# Altium project LSS_Top_Board_v3.5.PrjPcb (part 4 of 5)

## Sheet Motor-Driver-Sheet.SchDoc
size A4; DocumentNumber: 6; SheetNumber: 6; SheetTotal: 10
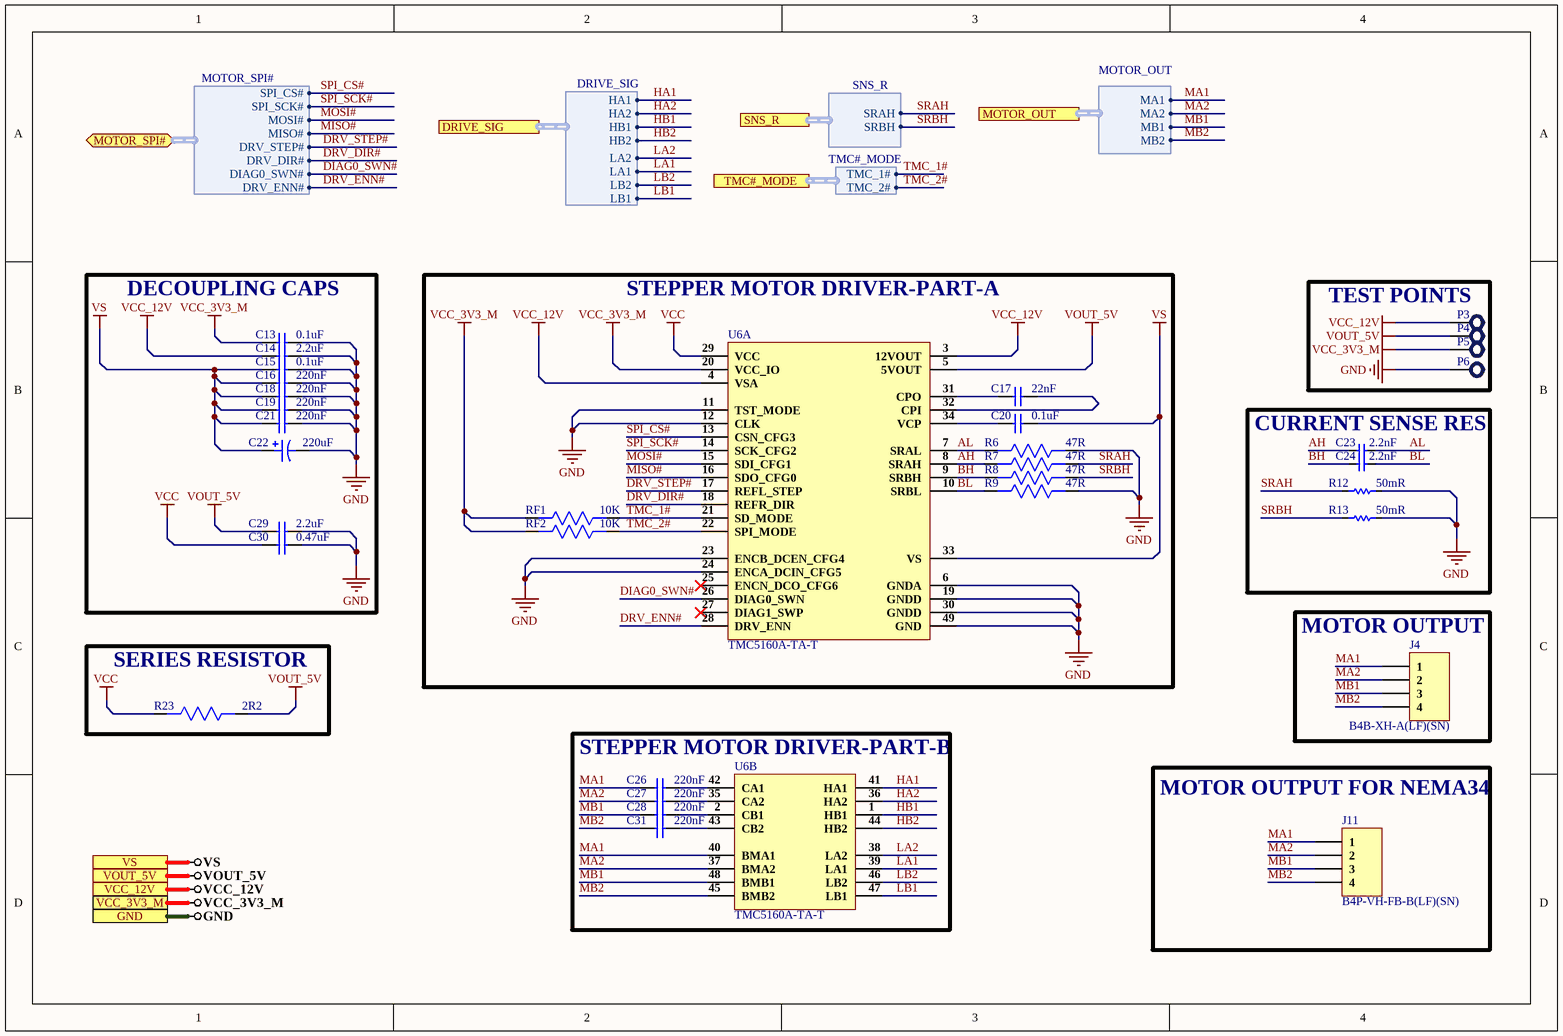
[diagram p5: Motor-Driver-Sheet.SchDoc]

### Parts
C13  0.1uF  [Cap 0603]
C14  2.2uF  [Cap 0603]
C15  0.1uF  [Cap 0603]
C16  220nF  [Cap0805]
C17  22nF  [Cap 0603]
C18  220nF  [Cap0805]
C19  220nF  [Cap0805]
C20  0.1uF  [Cap 0603]
C21  220nF  [Cap0805]
C22  220uF  [189RV0038]
C23  2.2nF  [Cap-0603]
C24  2.2nF  [Cap-0603]
C26  220nF  [Cap0805]
C27  220nF  [Cap0805]
C28  220nF  [Cap0805]
C29  2.2uF  [Cap 0603]
C30  0.47uF  [Cap 0603]
C31  220nF  [Cap0805]
J4  B4B-XH-A(LF)(SN)  [B4B-XH-A(LF)(SN)]
J11  B4P-VH-FB-B(LF)(SN)  [B4P-VH-FB-B(LF)(SN)]
P3  Test Point  [TEST POINT]  (value not drawn)
P4  Test Point  [TEST POINT]  (value not drawn)
P5  Test Point  [TEST POINT]  (value not drawn)
P6  Test Point  [TEST POINT]  (value not drawn)
R6  47R  [Res0603]
R7  47R  [Res0603]
R8  47R  [Res0603]
R9  47R  [Res0603]
R12  50mR  [RES-2512]
R13  50mR  [RES-2512]
R23  2R2  [Res0603]
RF1  10K  [Res0603]
RF2  10K  [Res0603]
U6  TMC5160A-TA-T  [48-tqfp-ep (7x7)]  (parts A,B of 2)

### Blocks framed on the sheet
DECOUPLING CAPS: C13-C16 C18 C19 C21 C22 C29 C30
STEPPER MOTOR DRIVER-PART-A: C17 C20 R6-R9 RF1 RF2 U6
TEST POINTS: P3-P6
CURRENT SENSE RES: C23 C24 R12 R13
MOTOR OUTPUT: J4
SERIES RESISTOR: R23
STEPPER MOTOR DRIVER-PART-B: C26-C28 C31 U6
MOTOR OUTPUT FOR NEMA34: J11

### Ports
DRIVE_SIG (harness DRIVE_SIG), GND, MOTOR_OUT (harness MOTOR_OUT), MOTOR_SPI# (bidir, harness MOTOR_SPI#), SNS_R (harness SNS_R), TMC#_MODE (harness TMC#_MODE), VCC_3V3_M, VCC_12V, VOUT_5V, VS

### Harnesses
SNS_R: SRAH, SRBH
DRIVE_SIG: HA1, HA2, HB1, HB2, LA2, LA1, LB2, LB1
MOTOR_OUT: MA1, MA2, MB1, MB2
TMC#_MODE: TMC_1#, TMC_2#
MOTOR_SPI#: SPI_CS#, SPI_SCK#, MOSI#, MISO#, DRV_STEP#, DRV_DIR#, DIAG0_SWN#, DRV_ENN#

### Nets
GND: C13.2 C14.2 C15.2 C16.2 C18.2 C19.2 C21.2 C22.2 C29.2 C30.2 P6.1 R6.1 R9.1 R12.2 R13.2 U6.6(GNDA) U6.11(TST_MODE) U6.12(CLK) U6.19(GNDD) U6.23(ENCB_DCEN_CFG4) U6.24(ENCA_DCIN_CFG5) U6.30(GNDD) U6.49(GND) ; port GND
VCC: C30.1 R23.2 U6.29(VCC)
VCC_3V3_M: C13.1 P5.1 RF1.2 RF2.2 U6.20(VCC_IO) ; port VCC_3V3_M
VCC_12V: C14.1 P3.1 U6.3(12VOUT) U6.4(VSA) ; port VCC_12V
VOUT_5V: C29.1 P4.1 R23.1 U6.5(5VOUT) ; port VOUT_5V
VS: C15.1 C16.1 C18.1 C19.1 C20.2 C21.1 C22.1 U6.33(VS) ; port VS
AH: C23.1 R7.2 U6.8(SRAH)
AL: C23.2 R6.2 U6.7(SRAL)
BH: C24.1 R8.2 U6.9(SRBH)
BL: C24.2 R9.2 U6.10(SRBL)
DIAG0_SWN#: U6.26(DIAG0_SWN) ; port MOTOR_SPI#.DIAG0_SWN#
DRV_DIR#: U6.18(REFR_DIR) ; port MOTOR_SPI#.DRV_DIR#
DRV_ENN#: U6.28(DRV_ENN) ; port MOTOR_SPI#.DRV_ENN#
DRV_STEP#: U6.17(REFL_STEP) ; port MOTOR_SPI#.DRV_STEP#
HA1: U6.41(HA1) ; port DRIVE_SIG.HA1
HA2: U6.36(HA2) ; port DRIVE_SIG.HA2
HB1: U6.1(HB1) ; port DRIVE_SIG.HB1
HB2: U6.44(HB2) ; port DRIVE_SIG.HB2
LA1: U6.39(LA1) ; port DRIVE_SIG.LA1
LA2: U6.38(LA2) ; port DRIVE_SIG.LA2
LB1: U6.47(LB1) ; port DRIVE_SIG.LB1
LB2: U6.46(LB2) ; port DRIVE_SIG.LB2
MA1: C26.1 J4.1 J11.1 U6.40(BMA1) ; port MOTOR_OUT.MA1
MA2: C27.1 J4.2 J11.2 U6.37(BMA2) ; port MOTOR_OUT.MA2
MB1: C28.1 J4.3 J11.3 U6.48(BMB1) ; port MOTOR_OUT.MB1
MB2: C31.1 J4.4 J11.4 U6.45(BMB2) ; port MOTOR_OUT.MB2
MISO#: U6.16(SDO_CFG0) ; port MOTOR_SPI#.MISO#
MOSI#: U6.15(SDI_CFG1) ; port MOTOR_SPI#.MOSI#
SPI_CS#: U6.13(CSN_CFG3) ; port MOTOR_SPI#.SPI_CS#
SPI_SCK#: U6.14(SCK_CFG2) ; port MOTOR_SPI#.SPI_SCK#
SRAH: R7.1 R12.1 ; port SNS_R.SRAH
SRBH: R8.1 R13.1 ; port SNS_R.SRBH
TMC_1#: RF1.1 U6.21(SD_MODE) ; port TMC#_MODE.TMC_1#
TMC_2#: RF2.1 U6.22(SPI_MODE) ; port TMC#_MODE.TMC_2#
NetC17_1: C17.1 U6.31(CPO)
NetC17_2: C17.2 U6.32(CPI)
NetC20_1: C20.1 U6.34(VCP)
NetC26_2: C26.2 U6.42(CA1)
NetC27_2: C27.2 U6.35(CA2)
NetC28_2: C28.2 U6.2(CB1)
NetC31_2: C31.2 U6.43(CB2)

Not connected (* = marked no-connect by the designer): U6 25(ENCN_DCO_CFG6)* 27(DIAG1_SWP)*

### Library data of the parts
C13 C15 C20 = CL10B104KB8NNNC: Cap Ceramic 0.1uF 50VDC X7R 10% SMD 0603 Paper T/R; Manufacturer: Samsung; Capacitance: 100nF; Voltage Rating: 50V; Supplier 1: Digi-Key; Manufacturer Part Number: CL10B104KB8NNNC; RoHS: Yes; Category: Ceramic Capacitors; Stock 1: 3998791; Pricing 1: 1=0.10000, 10=0.03000, 50=0.01640, 100=0.01340, 500=0.00954, 1000=0.00750 (USD); Mount: Surface Mount; Case/Package: 0603; Case Code (Metric): 1608; Case Code (Imperial): 0603; Material: Ceramic; Contact Plating: Tin; Min Operating Temperature: -55°C; Max Operating Temperature: 125°C; Dielectric: X7R; Tolerance: 10%; Package Quantity: 1; Packaging: Tape and Reel; Voltage: 50V; Voltage Rating (DC): 50V; Series: CL; Construction: Flat; Length: 1.6mm; Width: 0.031inch; Height: 0.8mm; Depth: 0.8mm; Thickness: 0.035inch; Radiation Hardening: No; Lead Free: Lead Free; RoHS Compliant: Yes; ComponentLink1URL: https://datasheet.ciiva.com/25803/cl10b104kb8nnnc-25803393.pdf?src-supplier=Digi-Key; ComponentLink1Description: https://datasheet.ciiva.com/25803/cl10b104kb8nnnc-25803393.pdf?src-supplier=Digi-Key; ComponentLink2URL: https://datasheet.ciiva.com/26838/getdatasheetpartid-89097-26838411.pdf?src-supplier=Verical; ComponentLink2Description: https://datasheet.ciiva.com/26838/getdatasheetpartid-89097-26838411.pdf?src-supplier=Verical; ComponentLink3URL: https://datasheet.ciiva.com/29198/456651-da-01-en-vs-kondensator-0605-29198839.pdf?src-supplier=Conrad; ComponentLink3Description: https://datasheet.ciiva.com/29198/456651-da-01-en-vs-kondensator-0605-29198839.pdf?src-supplier=Conrad; Supplier Part Number 1: 1276-1000-1-ND
C14 C29 = GRM188R6YA225KA12D: CAP, 2.2µF, 35V, 10%, X5R, 0603; Manufacturer: Murata; Material: Ceramic; Supplier 1: Digi-Key; Manufacturer Part Number: GRM188R6YA225KA12D; RoHS: Yes; Category: Ceramic Capacitors; Stock 1: 81665; Pricing 1: 1=0.21000, 10=0.14100, 50=0.08480, 100=0.07170, 500=0.04904, 1000=0.04338 (USD); Mount: Surface Mount; Case/Package: 0603; Case Code (Metric): 1608; Case Code (Imperial): 0603; Weight: 0.000222oz; Min Operating Temperature: -55°C; Max Operating Temperature: 85°C; Package Quantity: 4000; Packaging: Tape and Reel; Capacitance: 2.2uF; Tolerance: 10%; Voltage Rating: 35V; Dielectric: X5R; Voltage: 35V; Termination: SMD/SMT; Voltage Rating (DC): 35V; Series: GRM; Length: 1.6mm; Width: 0.8mm; Height: 0.8mm; Thickness: 0.035inch; Depth: 0.8mm; REACH SVHC: No SVHC; Lead Free: Lead Free; RoHS Compliant: Yes; ComponentLink1URL: https://datasheet.ciiva.com/14906/partnumbering-e-01-14906490.pdf?src-supplier=Digi-Key; ComponentLink1Description: https://datasheet.ciiva.com/14906/partnumbering-e-01-14906490.pdf?src-supplier=Digi-Key; ComponentLink2URL: https://datasheet.ciiva.com/14906/partnumbering-e-01-14906491.pdf?src-supplier=Digi-Key; ComponentLink2Description: https://datasheet.ciiva.com/14906/partnumbering-e-01-14906491.pdf?src-supplier=Digi-Key; ComponentLink3URL: https://datasheet.ciiva.com/14906/partnumbering-e-01-14906492.pdf?src-supplier=Digi-Key; ComponentLink3Description: https://datasheet.ciiva.com/14906/partnumbering-e-01-14906492.pdf?src-supplier=Digi-Key; Supplier Part Number 1: 490-7204-1-ND
C16 C18 C19 C21 = 08051C224K4T2A: Cap Ceramic 0.22uF 100V X7R 10% SMD 0805 125°C Embossed T/R; Manufacturer: Kyocera AVX; Supplier 1: Digi-Key; Manufacturer Part Number: 08051C224K4T2A; RoHS: Yes; Category: Ceramic Capacitors; Stock 1: 151; Pricing 1: 1=0.27000, 10=0.18500, 50=0.12320, 100=0.10470, 500=0.07392, 1000=0.06468 (USD); Mount: Surface Mount; Case/Package: 0805; Contact Plating: Tin; Min Operating Temperature: -55°C; Max Operating Temperature: 125°C; Termination: Wraparound; Tolerance: 10%; Capacitance: 220nF; Dielectric: X7R; Voltage Rating (DC): 100V; Length: 2.01mm; RoHS Compliant: Yes; ComponentLink1URL: http://datasheets.avx.com/AutoMLCC.pdf?src-supplier=Avnet+Asia; ComponentLink1Description: http://datasheets.avx.com/AutoMLCC.pdf?src-supplier=Avnet+Asia; Supplier Part Number 1: 478-13049-1-ND
C17 = CGA3E2X7R2A223K080AA: 0603 .022uF 100volts X7R 10% T=0.8mm; Manufacturer: TDK; Voltage Rating: 100V; Supplier 1: Digi-Key; Manufacturer Part Number: CGA3E2X7R2A223K080AA; RoHS: Yes; Category: Ceramic Capacitors; Stock 1: 56079; Pricing 1: 1=0.11000, 10=0.07600, 50=0.04340, 100=0.03590, 500=0.02516, 1000=0.02083 (USD); Mount: Surface Mount; Case/Package: 0603; Case Code (Metric): 1608; Case Code (Imperial): 0603; Weight: 7.1E-05oz; Min Operating Temperature: -55°C; Max Operating Temperature: 125°C; Capacitance: 22nF; Tolerance: 10%; Packaging: Tape and Reel; Voltage Rating (DC): 100V; Dielectric: X7R; Termination: SMD/SMT; Series: CGA; Package Quantity: 1; Resistor Type: Ceramic; Length: 1.6mm; Width: 0.031inch; Height: 0.8mm; Thickness: 0.035inch; Depth: 0.8mm; Ratings: AEC-Q200; RoHS Compliant: Yes; REACH SVHC: No SVHC; ComponentLink1URL: https://datasheet.ciiva.com/22725/1735406-22725648.pdf?src-supplier=Element14; ComponentLink1Description: https://datasheet.ciiva.com/22725/1735406-22725648.pdf?src-supplier=Element14; ComponentLink2URL: https://datasheet.ciiva.com/24218/cga3e2x7r2a223k080aa-266292-24218959.pdf?src-supplier=Mouser; ComponentLink2Description: https://datasheet.ciiva.com/24218/cga3e2x7r2a223k080aa-266292-24218959.pdf?src-supplier=Mouser; ComponentLink3URL: https://datasheet.ciiva.com/7975/1807242-7975349.pdf?src-supplier=Element14; ComponentLink3Description: https://datasheet.ciiva.com/7975/1807242-7975349.pdf?src-supplier=Element14; Supplier Part Number 1: 445-5814-1-ND
C22 = 189RV0038: 220uF 63V 225mA@100KHz ±20% SMD,D10xL10.5mm Aluminum Electrolytic Capacitors - SMD ROHS; Manufacturer: KNSCHA; Manufacturer Part Number: 189RV0038; Package: SMD,D10xL10.5mm; LCSC Part Number: C7471900; Item Type: Capacitor; ComponentLink1Description: LCSC; ComponentLink1URL: https://www.lcsc.com/product-detail/Aluminum-Electrolytic-Capacitors-SMD_KNSCHA-189RV0038_C7471900.html
C23 C24 = CC0603KRX7R9BB222: CAP CER 2200PF 50V X7R 0603; Manufacturer: Yageo; Tolerance: 10%; Insulation Resistance: 10GR; Dissipation Factor: 2.5%; Supplier 1: RSComponents; Manufacturer Part Number: CC0603KRX7R9BB222; RoHS: Yes; Category: Ceramic Capacitors; Stock 1: 1; Pricing 1: 4000=0.00500 (USD); Mount: Surface Mount; Case/Package: 0603; Number of Pins: 2; Case Code (Metric): 1608; Case Code (Imperial): 0603; Min Operating Temperature: -55°C; Max Operating Temperature: 125°C; Capacitance: 2.2nF; Dielectric: X7R; Package Quantity: 1; Voltage Rating: 50V; Packaging: Tape and Reel; Voltage Rating (DC): 50V; Termination: SMD/SMT; Resistor Type: Ceramic; Voltage: 50V; Series: CC; Length: 1.6mm; Width: 0.031inch; Height: 0.8mm; Thickness: 0.035inch; Depth: 0.8mm; Radiation Hardening: No; REACH SVHC: No SVHC; Lead Free: Lead Free; Halogen Free: Halogen Free; RoHS Compliant: Yes; ComponentLink1URL: https://datasheet.ciiva.com/23768/1079489-23768004.pdf?src-supplier=Newark; ComponentLink1Description: https://datasheet.ciiva.com/23768/1079489-23768004.pdf?src-supplier=Newark; ComponentLink2URL: https://datasheet.ciiva.com/11788/0900766b8079c870-11788403.pdf?src-supplier=RSComponents; ComponentLink2Description: https://datasheet.ciiva.com/11788/0900766b8079c870-11788403.pdf?src-supplier=RSComponents; ComponentLink3URL: https://datasheet.ciiva.com/26862/getdatasheetpartid-403587-26862854.pdf?src-supplier=Verical; ComponentLink3Description: https://datasheet.ciiva.com/26862/getdatasheetpartid-403587-26862854.pdf?src-supplier=Verical; ComponentLink4URL: https://datasheet.ciiva.com/8033/70765-8033863.pdf?src-supplier=Element14; ComponentLink4Description: https://datasheet.ciiva.com/8033/70765-8033863.pdf?src-supplier=Element14; ComponentLink5URL: https://datasheet.ciiva.com/7978/1489800-7978172.pdf?src-supplier=Element14; ComponentLink5Description: https://datasheet.ciiva.com/7978/1489800-7978172.pdf?src-supplier=Element14; ComponentLink6URL: https://datasheet.ciiva.com/28450/1489800-28450632.pdf?src-supplier=Element14; ComponentLink6Description: https://datasheet.ciiva.com/28450/1489800-28450632.pdf?src-supplier=Element14; ComponentLink7URL: https://datasheet.ciiva.com/155/mlccorderingcode-155921.pdf?src-supplier=Digi-Key; ComponentLink7Description: https://datasheet.ciiva.com/155/mlccorderingcode-155921.pdf?src-supplier=Digi-Key; ComponentLink8URL: https://datasheet.ciiva.com/155/mlccorderingcode-155920.pdf?src-supplier=Digi-Key; ComponentLink8Description: https://datasheet.ciiva.com/155/mlccorderingcode-155920.pdf?src-supplier=Digi-Key; ComponentLink9URL: https://datasheet.ciiva.com/155/mlccorderingcode-155922.pdf?src-supplier=Digi-Key; ComponentLink9Description: https://datasheet.ciiva.com/155/mlccorderingcode-155922.pdf?src-supplier=Digi-Key; ComponentLink10URL: https://datasheet.ciiva.com/8033/1489800-8033864.pdf?src-supplier=Element14; ComponentLink10Description: https://datasheet.ciiva.com/8033/1489800-8033864.pdf?src-supplier=Element14; ComponentLink11URL: https://datasheet.ciiva.com/8033/1489800-8033862.pdf?src-supplier=Element14; ComponentLink11Description: https://datasheet.ciiva.com/8033/1489800-8033862.pdf?src-supplier=Element14; ComponentLink12URL: https://datasheet.ciiva.com/16625/upy-gphc-x7r-6-3v-to-50v-8-16625531.pdf?src-supplier=Avnet+Europe; ComponentLink12Description: https://datasheet.ciiva.com/16625/upy-gphc-x7r-6-3v-to-50v-8-16625531.pdf?src-supplier=Avnet+Europe; Supplier Part Number 1: 6169509; LCSC Part Number: C107082
C26-C28 C31 = 08051C224K4T2A: CAP CER 0.22UF 100V X7R 0805; Manufacturer: Kyocera AVX; Tolerance: 10%; Supplier 1: Digi-Key; Manufacturer Part Number: 08051C224K4T2A; RoHS: Yes; Category: Ceramic Capacitors; Stock 1: 151; Pricing 1: 1=0.27000, 10=0.18500, 50=0.12320, 100=0.10470, 500=0.07392, 1000=0.06468 (USD); Mount: Surface Mount; Case/Package: 0805; Contact Plating: Tin; Min Operating Temperature: -55°C; Max Operating Temperature: 125°C; Termination: Wraparound; Capacitance: 220nF; Dielectric: X7R; Voltage Rating (DC): 100V; Length: 2.01mm; RoHS Compliant: Yes; ComponentLink1URL: http://datasheets.avx.com/AutoMLCC.pdf?src-supplier=Avnet+Asia; ComponentLink1Description: http://datasheets.avx.com/AutoMLCC.pdf?src-supplier=Avnet+Asia; Supplier Part Number 1: 478-13049-1-ND
C30 = UMK107B7474KA-TR: CAP CER 0.47uF 50V X7R 0603; Manufacturer: Taiyo Yuden; Tolerance: 10%; Capacitance: 470nF; Supplier 1: Digi-Key; Manufacturer Part Number: UMK107B7474KA-TR; RoHS: Yes; Category: Ceramic Capacitors; Stock 1: 81; Pricing 1: 1=0.21000, 10=0.14800, 50=0.08400, 100=0.06950, 500=0.04876, 1000=0.04036 (USD); Mount: Surface Mount; Case/Package: 0603; Case Code (Metric): 1608; Case Code (Imperial): 0603; Min Operating Temperature: -55°C; Max Operating Temperature: 125°C; Packaging: Tape and Reel; Voltage Rating: 50V; Package Quantity: 1; Dielectric: X7R; Termination: SMD/SMT; Voltage: 50V; Series: M; Voltage Rating (DC): 50V; Construction: Flat; Length: 1.6mm; Width: 0.031inch; Height: 0.8mm; Depth: 0.8mm; Thickness: 0.035inch; Radiation Hardening: No; RoHS Compliant: Yes; Lead Free: Lead Free; Halogen Free: Halogen Free; ComponentLink1URL: https://datasheet.ciiva.com/30063/972umk107b7474ka-tr-30063804.pdf?src-supplier=Onlinecomponents.com; ComponentLink1Description: https://datasheet.ciiva.com/30063/972umk107b7474ka-tr-30063804.pdf?src-supplier=Onlinecomponents.com; ComponentLink2URL: https://datasheet.ciiva.com/11600/umk107b7474ka-tr-ss-11600367.pdf?src-supplier=Avnet; ComponentLink2Description: https://datasheet.ciiva.com/11600/umk107b7474ka-tr-ss-11600367.pdf?src-supplier=Avnet; ComponentLink3URL: https://datasheet.ciiva.com/15922/257umk107b7474ka-tr-15922607.pdf?src-supplier=Onlinecomponents.com; ComponentLink3Description: https://datasheet.ciiva.com/15922/257umk107b7474ka-tr-15922607.pdf?src-supplier=Onlinecomponents.com; ComponentLink4URL: https://datasheet.ciiva.com/6274/mlcc-all-e-6274710.pdf?src-supplier=Digi-Key; ComponentLink4Description: https://datasheet.ciiva.com/6274/mlcc-all-e-6274710.pdf?src-supplier=Digi-Key; ComponentLink5URL: https://datasheet.ciiva.com/5412/mlcc01-e-5412119.pdf?src-supplier=Mouser; ComponentLink5Description: https://datasheet.ciiva.com/5412/mlcc01-e-5412119.pdf?src-supplier=Mouser; ComponentLink6URL: https://datasheet.ciiva.com/6274/mlcc-all-e-6274712.pdf?src-supplier=Digi-Key; ComponentLink6Description: https://datasheet.ciiva.com/6274/mlcc-all-e-6274712.pdf?src-supplier=Digi-Key; ComponentLink7URL: https://datasheet.ciiva.com/6274/mlcc-all-e-6274713.pdf?src-supplier=Digi-Key; ComponentLink7Description: https://datasheet.ciiva.com/6274/mlcc-all-e-6274713.pdf?src-supplier=Digi-Key; Supplier Part Number 1: 587-3170-1-ND
J4 = B4B-XH-A(LF)(SN): CONN HEADER VERT 4POS 2.5MM; Manufacturer: JST; Current Rating: 3A; Gender: Male; Contact Resistance: 20mR; Voltage Rating (AC): 250V; Connector Type: Male Pin; Number of Positions: 4; Insulation Resistance: 1GR; Wire/Cable Gauge: 22AWG; Supplier 1: Future Electronics; Manufacturer Part Number: B4B-XH-A(LF)(SN); RoHS: Yes; Category: FFC / FPC; Pricing 1: 1=0.13000, 300=0.11300, 1000=0.11000, 3000=0.10700, 10000=0.10400 (USD); Mount: Through Hole; Contact Material: Brass; Material: Polyamide; Contact Plating: Tin,Copper,Lead; Color: Natural; Housing Material: Polyamide; Housing Color: White; Min Operating Temperature: -25°C; Max Operating Temperature: 85°C; Number of Rows: 1; Max Current Rating: 3A; Package Quantity: 500; Packaging: Bulk; Voltage Rating: 250V; Termination: Press-Fit; Max Voltage Rating (AC): 250V; Max Voltage Rating (DC): 250V; Number of Contacts: 4; Orientation: Straight; Length: 12.4mm; Pitch: 2.5mm; Lead Pitch: 2.5mm; Depth: 5.75mm; REACH SVHC: No SVHC; Lead Free: Lead Free; ComponentLink1URL: https://datasheet.ciiva.com/26894/getdatasheetpartid-455616-26894787.pdf?src-supplier=Verical; ComponentLink1Description: https://datasheet.ciiva.com/26894/getdatasheetpartid-455616-26894787.pdf?src-supplier=Verical; ComponentLink2URL: https://datasheet.ciiva.com/26924/getdatasheetpartid-640571-26924035.pdf?src-supplier=Verical; ComponentLink2Description: https://datasheet.ciiva.com/26924/getdatasheetpartid-640571-26924035.pdf?src-supplier=Verical; ComponentLink3URL: https://datasheet.ciiva.com/16203/b4b-xh-alfsn-16203642.pdf?src-supplier=Future+Electronics; ComponentLink3Description: https://datasheet.ciiva.com/16203/b4b-xh-alfsn-16203642.pdf?src-supplier=Future+Electronics; ComponentLink4URL: https://datasheet.ciiva.com/726/exh-726404.pdf?src-supplier=Digi-Key; ComponentLink4Description: https://datasheet.ciiva.com/726/exh-726404.pdf?src-supplier=Digi-Key; Supplier Part Number 1: 8134090
J11 = B4P-VH-FB-B(LF)(SN): CONN HEADER VERT 4POS 3.96MM; Manufacturer: JST; Number of Positions: 4; Supplier 1: Future Electronics; Manufacturer Part Number: B4P-VH-FB-B(LF)(SN); RoHS: Yes; Category: Connectors; Pricing 1: 1=0.22000, 200=0.19300, 500=0.18800, 2000=0.18200, 5000=0.17800 (USD); Mount: Through Hole; Termination: Crimp; Pitch: 3.96mm; Lead Free: Lead Free; ComponentLink1URL: https://datasheet.ciiva.com/16292/b4p-vh-fb-blfsn-16292309.pdf?src-supplier=Future+Electronics; ComponentLink1Description: https://datasheet.ciiva.com/16292/b4p-vh-fb-blfsn-16292309.pdf?src-supplier=Future+Electronics; Supplier Part Number 1: 4271011
P3-P6 = TEST POINT: Test Point ON
R6-R9 = RC0603FR-0747RL: RES SMD 47OHM 0.1W 0603; Manufacturer: Yageo; Tolerance: 1%; Power Rating: 100mW; Voltage Rating (DC): 50V; Temperature Coefficient: 100ppm/°C; Voltage Rating: 75V; Supplier 1: Digi-Key; Manufacturer Part Number: RC0603FR-0747RL; RoHS: Yes; Category: Chip SMD Resistors; Stock 1: 596562; Pricing 1: 1=0.10000, 10=0.02400, 100=0.00970, 1000=0.00436, 2500=0.00378 (USD); Case/Package: 0603; Number of Pins: 2; Case Code (Imperial): 0603; Case Code (Metric): 1608; Weight: 7.1E-05oz; Size Code: 0603; Min Operating Temperature: -55°C; Max Operating Temperature: 155°C; Resistance: 47R; Packaging: Tape and Reel; Package Quantity: 1; Termination: SMD/SMT; Resistor Type: Thick Film; Number of Terminations: 2; Max Power Dissipation: 100mW; Features: Moisture Resistant; Series: RC; Construction: Rectangular; Resistance Tolerance: 1%; Length: 1.6mm; Width: 0.8mm; Height: 0.022inch; Depth: 0.8mm; REACH SVHC: Unknown; Lead Free: Lead Free; Military Standard: Not; RoHS Compliant: Yes; ComponentLink1URL: https://datasheet.ciiva.com/2453/pyu-r-int-thick-7-2453922.pdf?src-supplier=Digi-Key; ComponentLink1Description: https://datasheet.ciiva.com/2453/pyu-r-int-thick-7-2453922.pdf?src-supplier=Digi-Key; ComponentLink2URL: https://datasheet.ciiva.com/2453/pyu-r-int-thick-7-2453923.pdf?src-supplier=Digi-Key; ComponentLink2Description: https://datasheet.ciiva.com/2453/pyu-r-int-thick-7-2453923.pdf?src-supplier=Digi-Key; ComponentLink3URL: https://datasheet.ciiva.com/2453/pyu-r-int-thick-7-2453924.pdf?src-supplier=Digi-Key; ComponentLink3Description: https://datasheet.ciiva.com/2453/pyu-r-int-thick-7-2453924.pdf?src-supplier=Digi-Key; ComponentLink4URL: https://datasheet.ciiva.com/7746/443971-7746363.pdf?src-supplier=Element14; ComponentLink4Description: https://datasheet.ciiva.com/7746/443971-7746363.pdf?src-supplier=Element14; ComponentLink5URL: https://datasheet.ciiva.com/7746/443971-7746364.pdf?src-supplier=Element14; ComponentLink5Description: https://datasheet.ciiva.com/7746/443971-7746364.pdf?src-supplier=Element14; ComponentLink6URL: https://datasheet.ciiva.com/46440/1868787-46440908.pdf?src-supplier=Element14; ComponentLink6Description: https://datasheet.ciiva.com/46440/1868787-46440908.pdf?src-supplier=Element14; Supplier Part Number 1: 311-47.0HRCT-ND
R12 R13 = CRH2512FR050E04Z: 2W 50mΩ ±1% 2512 Current Sense Resistors/Shunt Resistors ROHS; Manufacturer: Ever Ohms Tech; Manufacturer Part Number: CRH2512FR050E04Z; Package: 2512; LCSC Part Number: C176035; ComponentLink1Description: LCSC; ComponentLink1URL: https://www.lcsc.com/product-detail/Current-Sense-Resistors-Shunt-Resistors_Ever-Ohms-Tech-CRH2512FR050E04Z_C176035.html; Item Type: Resistor
R23 = ERJ3GEYJ2R2V: RES SMD 2.2OHM 0603; Manufacturer: Panasonic; Manufacturer Part Number: ERJ-3GEYJ2R2V; Resistance: 2.2R; Tolerance: 5%; Temperature Coefficient: 600ppm/°C; Voltage Rating: 75V; Power Rating: 100mW; Voltage Rating (DC): 50V; Supplier 1: Digi-Key; RoHS: Yes; Category: Chip SMD Resistors; Stock 1: 2941010; Pricing 1: 1=0.10000, 10=0.05000, 100=0.02020, 1000=0.00905, 2500=0.00786 (USD); Mount: Surface Mount; Case/Package: 0603; Contact Plating: Tin; Case Code (Imperial): 0603; Case Code (Metric): 1608; Min Operating Temperature: -55°C; Max Operating Temperature: 155°C; Resistor Type: Thick Film; Packaging: Tape and Reel; Package Quantity: 1; Number of Terminations: 2; Termination: SMD/SMT; Max Power Dissipation: 100mW; Features: Automotive AEC-Q200; Series: ERJ; Resistance Tolerance: 5%; Construction: Rectangular; Technology: THICK FILM; Length: 1.6mm; Width: 0.8mm; Height: 0.45mm; Depth: 0.8mm; Radiation Hardening: No; REACH SVHC: No SVHC; Military Standard: Not; Lead Free: Lead Free; RoHS Compliant: Yes; ComponentLink1URL: https://datasheet.ciiva.com/11821/0900766b80f806dd-11821449.pdf?src-supplier=RSComponents; ComponentLink1Description: https://datasheet.ciiva.com/11821/0900766b80f806dd-11821449.pdf?src-supplier=RSComponents; ComponentLink2URL: https://datasheet.ciiva.com/46374/1500035-46374005.pdf?src-supplier=Element14; ComponentLink2Description: https://datasheet.ciiva.com/46374/1500035-46374005.pdf?src-supplier=Element14; ComponentLink3URL: https://datasheet.ciiva.com/9117/aoa0000ce1-9117159.pdf?src-supplier=Avnet; ComponentLink3Description: https://datasheet.ciiva.com/9117/aoa0000ce1-9117159.pdf?src-supplier=Avnet; ComponentLink4URL: https://datasheet.ciiva.com/24025/aoa0000ce1-37422-24025463.pdf?src-supplier=Mouser; ComponentLink4Description: https://datasheet.ciiva.com/24025/aoa0000ce1-37422-24025463.pdf?src-supplier=Mouser; ComponentLink5URL: https://datasheet.ciiva.com/16765/70255313-16765018.pdf?src-supplier=Allied+Electronics; ComponentLink5Description: https://datasheet.ciiva.com/16765/70255313-16765018.pdf?src-supplier=Allied+Electronics; ComponentLink6URL: https://datasheet.ciiva.com/30150/4aoa0000ce1-30150090.pdf?src-supplier=Onlinecomponents.com; ComponentLink6Description: https://datasheet.ciiva.com/30150/4aoa0000ce1-30150090.pdf?src-supplier=Onlinecomponents.com; ComponentLink7URL: https://datasheet.ciiva.com/46386/1500035-46386764.pdf?src-supplier=Element14; ComponentLink7Description: https://datasheet.ciiva.com/46386/1500035-46386764.pdf?src-supplier=Element14; ComponentLink8URL: https://datasheet.ciiva.com/16762/70255313-16762317.pdf?src-supplier=Allied+Electronics; ComponentLink8Description: https://datasheet.ciiva.com/16762/70255313-16762317.pdf?src-supplier=Allied+Electronics; ComponentLink9URL: https://datasheet.ciiva.com/17214/aoa0000ce1-17214157.pdf?src-supplier=Avnet+Europe; ComponentLink9Description: https://datasheet.ciiva.com/17214/aoa0000ce1-17214157.pdf?src-supplier=Avnet+Europe; Supplier Part Number 1: P2.2GCT-ND
RF1 RF2 = RC0603FR-0710KL: RES SMD 10K Ohm 1% 1/10W 0603; Manufacturer: Yageo; Resistance: 10kR; Temperature Coefficient: 100ppm/°C; Voltage Rating (DC): 50V; Power Rating: 100mW; Voltage Rating: 75V; Supplier 1: Digi-Key; Manufacturer Part Number: RC0603FR-0710KL; RoHS: Yes; Category: Chip SMD Resistors; Stock 1: 25249139; Pricing 1: 1=0.10000, 10=0.02400, 100=0.00970, 1000=0.00436, 2500=0.00378 (USD); Case/Package: 0603; Number of Pins: 2; Case Code (Imperial): 0603; Case Code (Metric): 1608; Weight: 7.1E-05oz; Size Code: 0603; Min Operating Temperature: -55°C; Max Operating Temperature: 155°C; Tolerance: 1%; Resistor Type: Thick Film; Packaging: Tape and Reel; Termination: SMD/SMT; Features: Moisture Resistant; Series: RC; Max Power Dissipation: 100mW; Number of Terminations: 2; Resistance Tolerance: 1%; Construction: Rectangular; Length: 1.6mm; Width: 0.8mm; Height: 0.45mm; Depth: 0.8mm; Lead Pitch: 0.3mm; REACH SVHC: Unknown; Lead Free: Lead Free; Military Standard: Not; RoHS Compliant: Yes; ComponentLink1URL: https://datasheet.ciiva.com/7660/38590-7660789.pdf?src-supplier=Element14; ComponentLink1Description: https://datasheet.ciiva.com/7660/38590-7660789.pdf?src-supplier=Element14; ComponentLink2URL: https://datasheet.ciiva.com/7983/443971-7983596.pdf?src-supplier=Element14; ComponentLink2Description: https://datasheet.ciiva.com/7983/443971-7983596.pdf?src-supplier=Element14; ComponentLink3URL: https://datasheet.ciiva.com/22747/443971-22747519.pdf?src-supplier=Element14; ComponentLink3Description: https://datasheet.ciiva.com/22747/443971-22747519.pdf?src-supplier=Element14; ComponentLink4URL: https://datasheet.ciiva.com/46440/1868787-46440891.pdf?src-supplier=Element14; ComponentLink4Description: https://datasheet.ciiva.com/46440/1868787-46440891.pdf?src-supplier=Element14; ComponentLink5URL: https://datasheet.ciiva.com/7746/1738695-7746239.pdf?src-supplier=Element14; ComponentLink5Description: https://datasheet.ciiva.com/7746/1738695-7746239.pdf?src-supplier=Element14; ComponentLink6URL: https://datasheet.ciiva.com/15189/getdatasheetpartid-409289-15189591.pdf?src-supplier=Verical; ComponentLink6Description: https://datasheet.ciiva.com/15189/getdatasheetpartid-409289-15189591.pdf?src-supplier=Verical; Supplier Part Number 1: 311-10.0KHRCT-ND
U6 = TMC5160A-TA-T: IC MTR DRVR BIPOLAR 8-60V 48TQFP; Manufacturer: Trinamic; Supplier 1: Digi-Key; Manufacturer Part Number: TMC5160A-TA-T; RoHS: Yes; Stock 1: 15584; Pricing 1: 1=6.83000, 10=6.13000, 25=5.79560, 100=5.02280, 250=4.76524, 500=4.27582, 1000=3.64500 (USD); Supplier Part Number 1: 1460-TMC5160A-TA-TCT-ND

## Sheet Driver-Sheet.SchDoc
size A4; DocumentNumber: 7; SheetNumber: 7; SheetTotal: 10
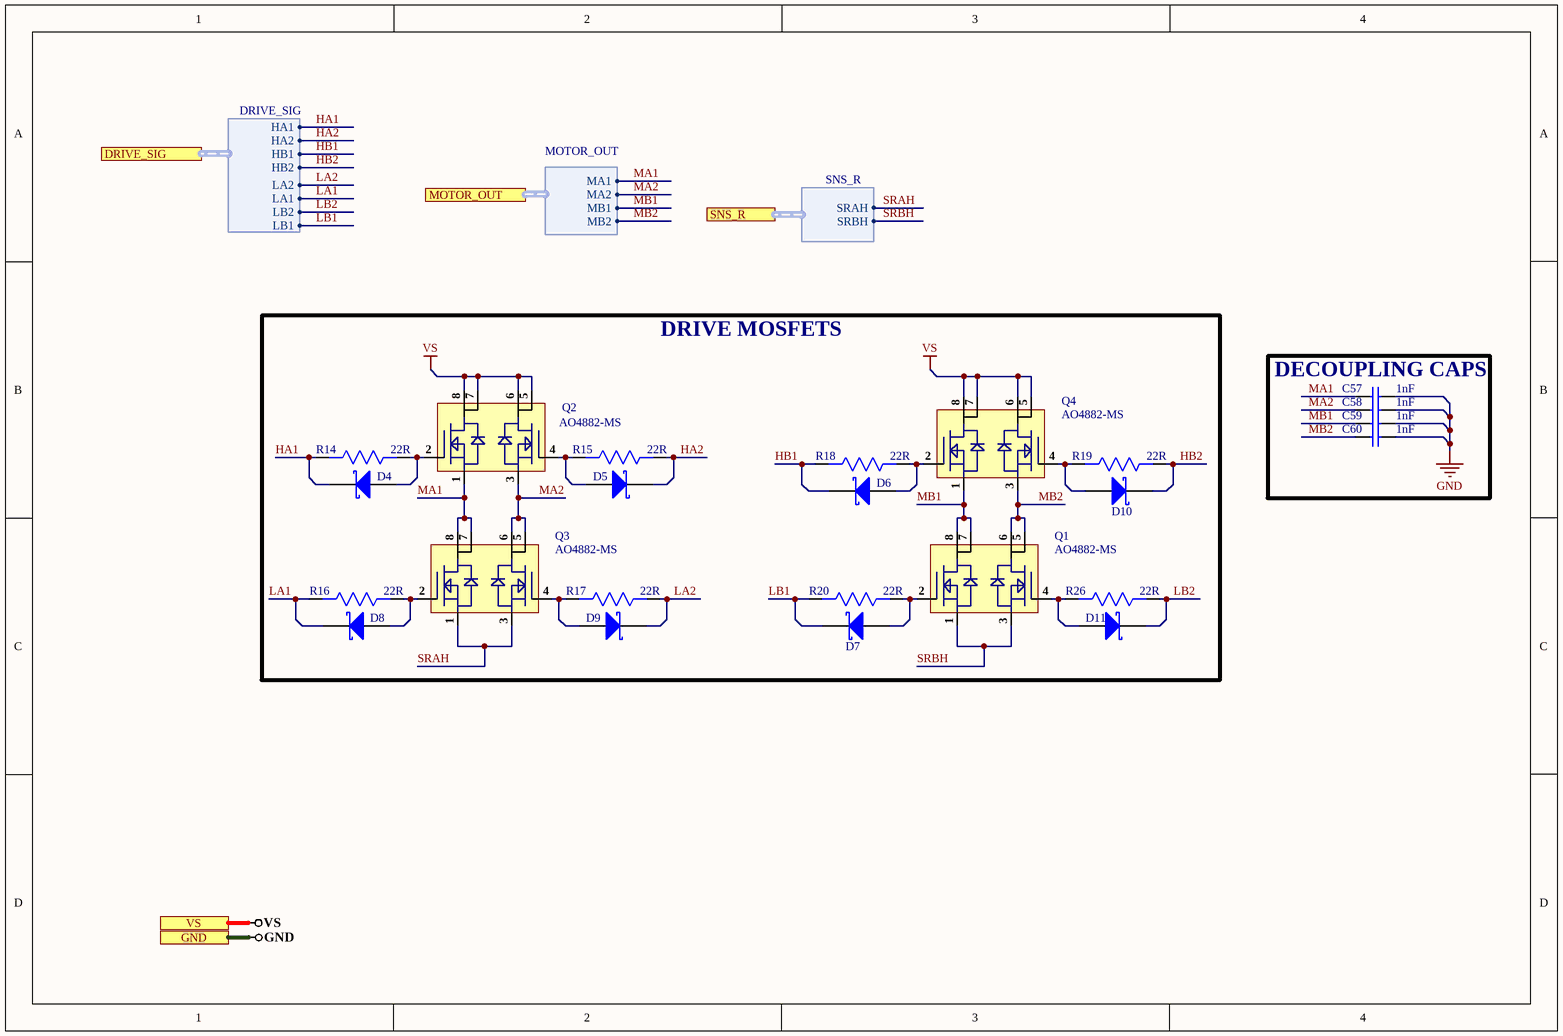
[diagram p6: Driver-Sheet.SchDoc]

### Parts
C57  1nF  [Cap 0603]
C58  1nF  [Cap 0603]
C59  1nF  [Cap 0603]
C60  1nF  [Cap 0603]
D4  CRS01(TE85L,Q,M)  [CRS01(TE85L,Q,M)]  (value not drawn)
D5  CRS01(TE85L,Q,M)  [CRS01(TE85L,Q,M)]  (value not drawn)
D6  CRS01(TE85L,Q,M)  [CRS01(TE85L,Q,M)]  (value not drawn)
D7  CRS01(TE85L,Q,M)  [CRS01(TE85L,Q,M)]  (value not drawn)
D8  CRS01(TE85L,Q,M)  [CRS01(TE85L,Q,M)]  (value not drawn)
D9  CRS01(TE85L,Q,M)  [CRS01(TE85L,Q,M)]  (value not drawn)
D10  CRS01(TE85L,Q,M)  [CRS01(TE85L,Q,M)]  (value not drawn)
D11  CRS01(TE85L,Q,M)  [CRS01(TE85L,Q,M)]  (value not drawn)
Q1  AO4882-MS  [AO4882-MS]
Q2  AO4882-MS  [AO4882-MS]
Q3  AO4882-MS  [AO4882-MS]
Q4  AO4882-MS  [AO4882-MS]
R14  22R  [Res0603]
R15  22R  [Res0603]
R16  22R  [Res0603]
R17  22R  [Res0603]
R18  22R  [Res0603]
R19  22R  [Res0603]
R20  22R  [Res0603]
R26  22R  [Res0603]

### Blocks framed on the sheet
DRIVE MOSFETS: D4-D11 Q1-Q4 R14-R20 R26
DECOUPLING CAPS: C57-C60

### Ports
DRIVE_SIG (harness DRIVE_SIG), GND, MOTOR_OUT (harness MOTOR_OUT), SNS_R (harness SNS_R), VS

### Harnesses
MOTOR_OUT: MA1, MA2, MB1, MB2
SNS_R: SRAH, SRBH
DRIVE_SIG: HA1, HA2, HB1, HB2, LA2, LA1, LB2, LB1

### Nets
GND: C57.2 C58.2 C59.2 C60.2 ; port GND
VS: Q2.5(D2) Q2.6(D2) Q2.7(D1) Q2.8(D1) Q4.5(D2) Q4.6(D2) Q4.7(D1) Q4.8(D1) ; port VS
HA1: D4.2(K) R14.2 ; port DRIVE_SIG.HA1
HA2: D5.2(K) R15.1 ; port DRIVE_SIG.HA2
HB1: D6.2(K) R18.2 ; port DRIVE_SIG.HB1
HB2: D10.2(K) R19.1 ; port DRIVE_SIG.HB2
LA1: D8.2(K) R16.2 ; port DRIVE_SIG.LA1
LA2: D9.2(K) R17.1 ; port DRIVE_SIG.LA2
LB1: D7.2(K) R20.2 ; port DRIVE_SIG.LB1
LB2: D11.2(K) R26.1 ; port DRIVE_SIG.LB2
MA1: C57.1 Q2.1(S1) Q3.7(D1) Q3.8(D1) ; port MOTOR_OUT.MA1
MA2: C58.1 Q2.3(S2) Q3.5(D2) Q3.6(D2) ; port MOTOR_OUT.MA2
MB1: C59.1 Q1.7(D1) Q1.8(D1) Q4.1(S1) ; port MOTOR_OUT.MB1
MB2: C60.1 Q1.5(D2) Q1.6(D2) Q4.3(S2) ; port MOTOR_OUT.MB2
SRAH: Q3.1(S1) Q3.3(S2) ; port SNS_R.SRAH
SRBH: Q1.1(S1) Q1.3(S2) ; port SNS_R.SRBH
NetD4_1: D4.1(A) Q2.2(G1) R14.1
NetD5_1: D5.1(A) Q2.4(G2) R15.2
NetD6_1: D6.1(A) Q4.2(G1) R18.1
NetD7_1: D7.1(A) Q1.2(G1) R20.1
NetD8_1: D8.1(A) Q3.2(G1) R16.1
NetD9_1: D9.1(A) Q3.4(G2) R17.2
NetD10_1: D10.1(A) Q4.4(G2) R19.2
NetD11_1: D11.1(A) Q1.4(G2) R26.2

### Library data of the parts
C57-C60 = CL10B102KC8NNNC: CAP CER 1nF 100V X7R 0603; Manufacturer: Samsung; Material: Ceramic; Tolerance: 10%; Supplier 1: Avnet; Manufacturer Part Number: CL10B102KC8NNNC; RoHS: Yes; Category: Ceramic Capacitors; Stock 1: 184000; Pricing 1: 4000=0.00988, 8000=0.00987, 16000=0.00986, 24000=0.00985, 32000=0.00984, 40000=0.00982, 400000=0.00981 (USD); Mount: Surface Mount; Case/Package: 0603; Case Code (Metric): 1608; Case Code (Imperial): 0603; Contact Plating: Tin; Min Operating Temperature: -55°C; Max Operating Temperature: 125°C; Capacitance: 1nF; Dielectric: X7R; Packaging: Tape and Reel; Package Quantity: 1; Voltage Rating: 100V; Voltage: 100V; Voltage Rating (DC): 100V; Series: CL; Construction: Flat; Length: 1.6mm; Width: 0.031inch; Height: 0.8mm; Thickness: 0.035inch; Depth: 0.8mm; Radiation Hardening: No; Lead Free: Lead Free; RoHS Compliant: Yes; ComponentLink1URL: https://datasheet.ciiva.com/25799/cl10b102kc8nnnc-25799476.pdf?src-supplier=Digi-Key; ComponentLink1Description: https://datasheet.ciiva.com/25799/cl10b102kc8nnnc-25799476.pdf?src-supplier=Digi-Key; ComponentLink2URL: https://datasheet.ciiva.com/29198/458286-da-01-en-vs-kondensator-0603-29198496.pdf?src-supplier=Conrad; ComponentLink2Description: https://datasheet.ciiva.com/29198/458286-da-01-en-vs-kondensator-0603-29198496.pdf?src-supplier=Conrad; ComponentLink3URL: https://datasheet.ciiva.com/26838/getdatasheetpartid-640779-26838395.pdf?src-supplier=Verical; ComponentLink3Description: https://datasheet.ciiva.com/26838/getdatasheetpartid-640779-26838395.pdf?src-supplier=Verical; ComponentLink4URL: https://datasheet.ciiva.com/26310/mlcc-catalogdownload2013-eng-26310266.pdf?src-supplier=Distrelec; ComponentLink4Description: https://datasheet.ciiva.com/26310/mlcc-catalogdownload2013-eng-26310266.pdf?src-supplier=Distrelec; ComponentLink5URL: https://datasheet.ciiva.com/16199/cl05b104kq5nnnc-16199246.pdf?src-supplier=Future+Electronics; ComponentLink5Description: https://datasheet.ciiva.com/16199/cl05b104kq5nnnc-16199246.pdf?src-supplier=Future+Electronics; Supplier Part Number 1: CL10B102KC8NNNC
D4-D11 = CRS01(TE85L,Q,M): DIODE SCHOTTKY 30V 1A SOD123F; Manufacturer: TOSHIBA; Supplier 1: Digi-Key; Manufacturer Part Number: CRS01(TE85L,Q,M); Stock 1: 72983
Q1-Q4 = AO4882-MS: 40V 6A 25mΩ@10V,6A 1.9W 1.6V@250uA 76pF@15V 2 N-Channel 1.013nF@15V 9.8nC@4.5V -55℃~+150℃@(Tj) SOP-8 MOSFETs ROHS; Manufacturer: MSKSEMI; Manufacturer Part Number: AO4882-MS; Footprint: SOP-8; ComponentLink1Description: LCSC; ComponentLink1URL: https://www.lcsc.com/product-detail/MOSFETs_MSKSEMI-AO4882-MS_C2847038.html
R14-R20 R26 = 0603WAF220JT5E: 22Ω 0603 Chip Resistor - Surface Mount ROHS; Manufacturer: UNI-ROYAL; ComponentLink1Description: LCSC; ComponentLink1URL: https://www.lcsc.com/product-detail/Chip-Resistor-Surface-Mount_UNI-ROYAL-Uniroyal-Elec-0603WAF220JT5E_C23345.html; Manufacturer Part Number: 0603WAF220JT5E; Footprint: 0603; Value: 22R

## Sheet Signal-Isolation-Section.SchDoc
size A4; DocumentNumber: 8; SheetNumber: 8; SheetTotal: 10
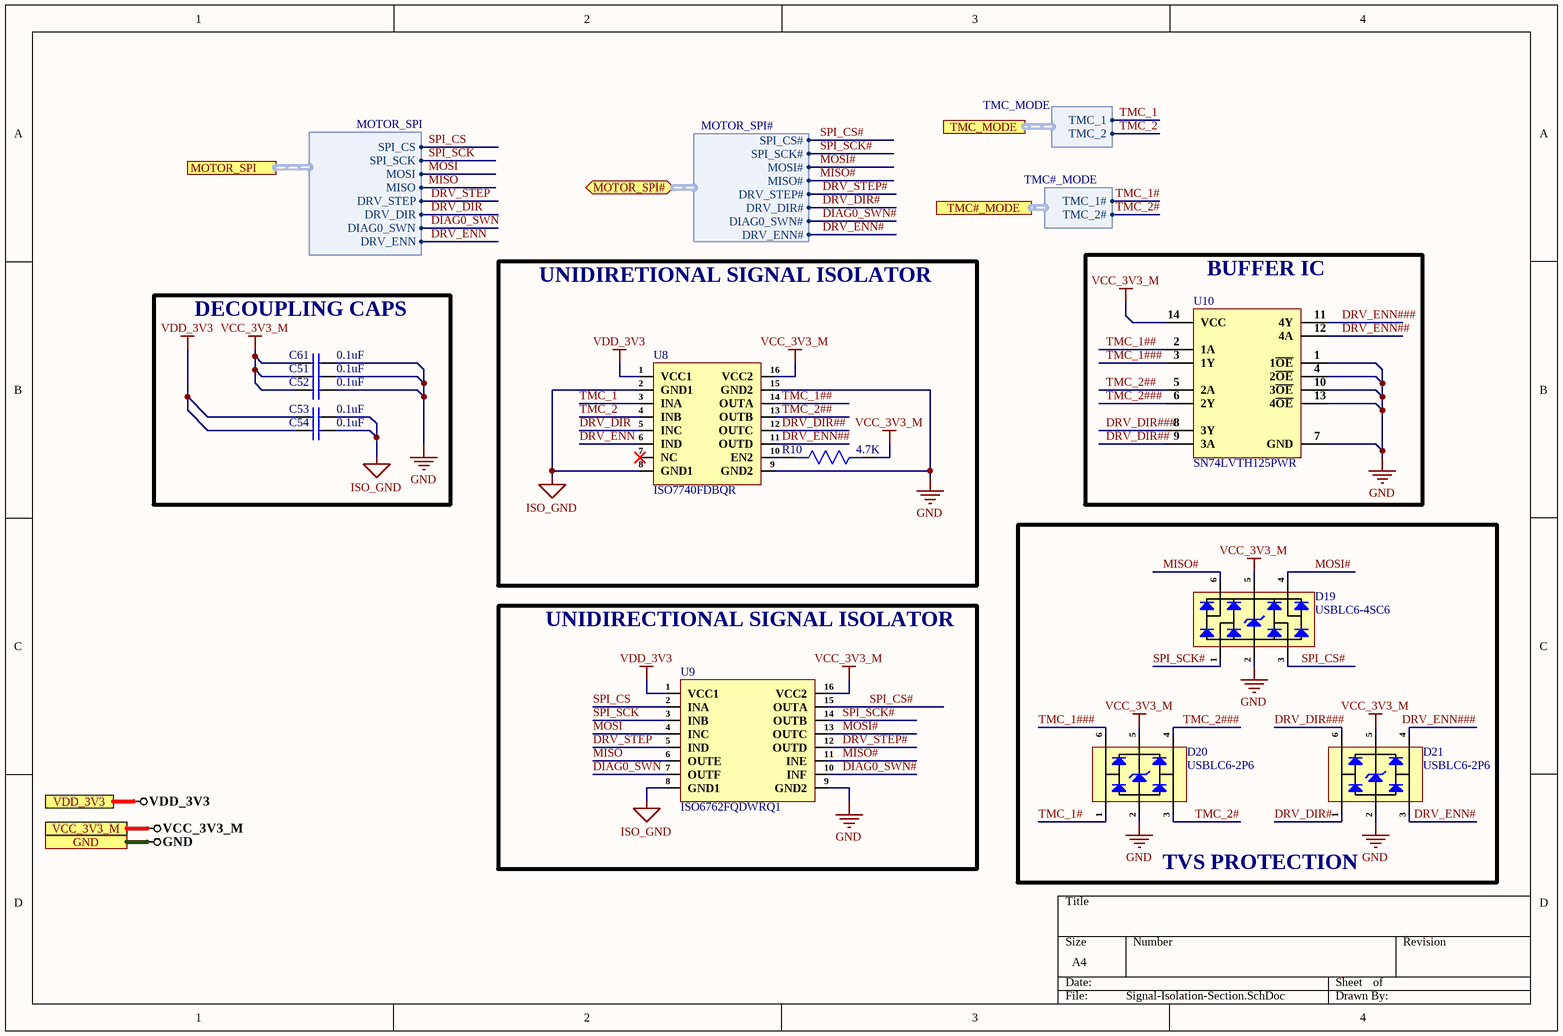
[diagram p7: Signal-Isolation-Section.SchDoc]

### Parts
C51  0.1uF  [Cap 0603]
C52  0.1uF  [Cap 0603]
C53  0.1uF  [Cap 0603]
C54  0.1uF  [Cap 0603]
C61  0.1uF  [Cap 0603]
D19  USBLC6-4SC6  [SOT-23-6]
D20  USBLC6-2P6  [SOT-666]
D21  USBLC6-2P6  [SOT-666]
R10  4.7K  [Res-0201]
U8  ISO7740FDBQR  [16-SSOP]
U9  ISO6762FQDWRQ1  [16-SOIC]
U10  SN74LVTH125PWR  [SN74LVTH125PWR]

### Blocks framed on the sheet
DECOUPLING CAPS: C51-C54 C61
UNIDIRETIONAL SIGNAL ISOLATOR: R10 U8
BUFFER IC: U10
TVS PROTECTION: D19-D21
UNIDIRECTIONAL SIGNAL ISOLATOR: U9

### Ports
GND, MOTOR_SPI (harness MOTOR_SPI), MOTOR_SPI# (bidir, harness MOTOR_SPI#), TMC#_MODE (harness TMC#_MODE), TMC_MODE (harness TMC_MODE), VCC_3V3_M, VDD_3V3

### Harnesses
MOTOR_SPI: SPI_CS, SPI_SCK, MOSI, MISO, DRV_STEP, DRV_DIR, DRV_ENN, DIAG0_SWN
MOTOR_SPI#: SPI_CS#, SPI_SCK#, MOSI#, MISO#, DRV_STEP#, DRV_DIR#, DIAG0_SWN#, DRV_ENN#
TMC_MODE: TMC_1, TMC_2
TMC#_MODE: TMC_1#, TMC_2#

### Nets
GND: C51.2 C52.2 C61.2 D19.2(GND) D20.2(GND) D21.2(GND) U8.9(GND2) U8.15(GND2) U9.9(GND2) U10.1(1~{OE}) U10.4(2~{OE}) U10.7(GND) U10.10(3~{OE}) U10.13(4~{OE}) ; port GND
ISO_GND: C53.2 C54.2 U8.2(GND1) U8.8(GND1) U9.8(GND1)
VCC_3V3_M: C51.1 C52.1 C61.1 D19.5(VBUS) D20.5(VBUS) D21.5(VBUS) R10.1 U8.16(VCC2) U9.16(VCC2) U10.14(VCC) ; port VCC_3V3_M
VDD_3V3: C53.1 C54.1 U8.1(VCC1) U9.1(VCC1) ; port VDD_3V3
DIAG0_SWN: U9.7(OUTF) ; port MOTOR_SPI.DIAG0_SWN
DIAG0_SWN#: U9.10(INF) ; port MOTOR_SPI#.DIAG0_SWN#
DRV_DIR: U8.5(INC) ; port MOTOR_SPI.DRV_DIR
DRV_DIR#: D21.1(I/O1) ; port MOTOR_SPI#.DRV_DIR#
DRV_DIR##: U8.12(OUTC) U10.9(3A)
DRV_DIR###: D21.6(I/O1) U10.8(3Y)
DRV_ENN: U8.6(IND) ; port MOTOR_SPI.DRV_ENN
DRV_ENN#: D21.3(I/O2) ; port MOTOR_SPI#.DRV_ENN#
DRV_ENN##: U8.11(OUTD) U10.12(4A)
DRV_ENN###: D21.4(I/O2) U10.11(4Y)
DRV_STEP: U9.5(IND) ; port MOTOR_SPI.DRV_STEP
DRV_STEP#: U9.12(OUTD) ; port MOTOR_SPI#.DRV_STEP#
MISO: U9.6(OUTE) ; port MOTOR_SPI.MISO
MISO#: D19.6(I/O4) U9.11(INE) ; port MOTOR_SPI#.MISO#
MOSI: U9.4(INC) ; port MOTOR_SPI.MOSI
MOSI#: D19.4(I/O3) U9.13(OUTC) ; port MOTOR_SPI#.MOSI#
SPI_CS: U9.2(INA) ; port MOTOR_SPI.SPI_CS
SPI_CS#: D19.3(I/O2) U9.15(OUTA) ; port MOTOR_SPI#.SPI_CS#
SPI_SCK: U9.3(INB) ; port MOTOR_SPI.SPI_SCK
SPI_SCK#: D19.1(I/O1) U9.14(OUTB) ; port MOTOR_SPI#.SPI_SCK#
TMC_1: U8.3(INA) ; port TMC_MODE.TMC_1
TMC_1#: D20.1(I/O1) ; port TMC#_MODE.TMC_1#
TMC_1##: U8.14(OUTA) U10.2(1A)
TMC_1###: D20.6(I/O1) U10.3(1Y)
TMC_2: U8.4(INB) ; port TMC_MODE.TMC_2
TMC_2#: D20.3(I/O2) ; port TMC#_MODE.TMC_2#
TMC_2##: U8.13(OUTB) U10.5(2A)
TMC_2###: D20.4(I/O2) U10.6(2Y)
NetR10_2: R10.2 U8.10(EN2)

Not connected (* = marked no-connect by the designer): U8 7(NC)*

### Library data of the parts
C51-C54 C61 = CL10B104KB8NNNC: as C13 on sheet Motor-Driver-Sheet; Supplier 1: Digi-Key; Manufacturer Part Number: CL10B104KB8NNNC; RoHS: Yes; Category: Ceramic Capacitors; Stock 1: 3998791; Pricing 1: 1=0.10000, 10=0.03000, 50=0.01640, 100=0.01340, 500=0.00954, 1000=0.00750 (USD); Mount: Surface Mount; Case/Package: 0603; Case Code (Metric): 1608; Case Code (Imperial): 0603; Material: Ceramic; Contact Plating: Tin; Min Operating Temperature: -55°C; Max Operating Temperature: 125°C; Dielectric: X7R; Tolerance: 10%; Package Quantity: 1; Packaging: Tape and Reel; Voltage: 50V; Voltage Rating (DC): 50V; Series: CL; Construction: Flat; Length: 1.6mm; Width: 0.031inch; Height: 0.8mm; Depth: 0.8mm; Thickness: 0.035inch; Radiation Hardening: No; Lead Free: Lead Free; RoHS Compliant: Yes; ComponentLink1URL: https://datasheet.ciiva.com/25803/cl10b104kb8nnnc-25803393.pdf?src-supplier=Digi-Key; ComponentLink1Description: https://datasheet.ciiva.com/25803/cl10b104kb8nnnc-25803393.pdf?src-supplier=Digi-Key; ComponentLink2URL: https://datasheet.ciiva.com/26838/getdatasheetpartid-89097-26838411.pdf?src-supplier=Verical; ComponentLink2Description: https://datasheet.ciiva.com/26838/getdatasheetpartid-89097-26838411.pdf?src-supplier=Verical; ComponentLink3URL: https://datasheet.ciiva.com/29198/456651-da-01-en-vs-kondensator-0605-29198839.pdf?src-supplier=Conrad; ComponentLink3Description: https://datasheet.ciiva.com/29198/456651-da-01-en-vs-kondensator-0605-29198839.pdf?src-supplier=Conrad; Supplier Part Number 1: 1276-1000-1-ND
D19 = USBLC6-4SC6: TVS DIODE 5.25VWM 17VC SOT23-6; Item Type: ESD Diode; Value: 4pF; Direction: Unidirectional; Reverse Standoff Voltage: 5V; Min Breakdown Voltage: 6V; Power Line Protection: Yes; Peak Pulse Current: 5A; Number of Elements: 1; Operating Supply Voltage: 860mV; Number of Channels: 4; Clamping Voltage: 17V; Polarity: Unidirectional,Bidirectional; Leakage Current: 150nA; Test Current: 1mA; Max Breakdown Voltage: 10V; Max Reverse Leakage Current: 2uA; LCSC Part Number: C111212; ComponentLink1Description: LCSC; Supplier: Mouser; Supplier Part Number: 511-USBLC6-4SC6; RoHS: Yes; Category: TVS Diodes; Stock: 148069; Pricing: 1=0.58, 10=0.512, 50=0.512, 100=0.381, 1000=0.271, 10000=0.211 (USD); Mounting Technology: Surface Mount; Case/Package: SOT-23; Pins: 6; Min Operating Temperature: -40°C; Max Operating Temperature: 125°C; Packaging: Tape and Reel; Series: USB; Reverse Breakdown Voltage: 6V; Breakdown Voltage: 6V; Termination: SMD/SMT; Working Voltage: 5V; ESD Protection: Yes; Voltage Rating (DC): 5V; Clamping Voltage-Max: 17V; Number of Unidirectional Channels: 4; Length: 3.05mm; Width: 1.75mm; Height: 1.3mm; Depth: 1.75mm; Radiation Hardening: No; Lead Free: Lead Free; RoHS Compliant: Yes; Reach SVHC Compliant: No; ComponentLink2URL: https://datasheet.ciiva.com/14186/usblc6-4-st-eng-tds-14186570.pdf?src-supplier=Distrelec; ComponentLink2Description: https://datasheet.ciiva.com/14186/usblc6-4-st-eng-tds-14186570.pdf?src-supplier=Distrelec; ComponentLink3URL: https://datasheet.ciiva.com/27052/1493951-27052291.pdf?src-supplier=Jameco; ComponentLink3Description: https://datasheet.ciiva.com/27052/1493951-27052291.pdf?src-supplier=Jameco; ComponentLink4URL: https://datasheet.ciiva.com/1220/48344-1220005.pdf?src-supplier=Newark; ComponentLink4Description: https://datasheet.ciiva.com/1220/48344-1220005.pdf?src-supplier=Newark; ComponentLink5URL: https://datasheet.ciiva.com/4507/cd00047494-112581-4507757.pdf?src-supplier=Mouser; ComponentLink5Description: https://datasheet.ciiva.com/4507/cd00047494-112581-4507757.pdf?src-supplier=Mouser; ComponentLink6URL: https://datasheet.ciiva.com/16206/cd00047494-16206119.pdf?src-supplier=Future+Electronics; ComponentLink6Description: https://datasheet.ciiva.com/16206/cd00047494-16206119.pdf?src-supplier=Future+Electronics; ComponentLink7URL: https://datasheet.ciiva.com/15143/getdatasheetpartid-88767-15143364.pdf?src-supplier=Verical; ComponentLink7Description: https://datasheet.ciiva.com/15143/getdatasheetpartid-88767-15143364.pdf?src-supplier=Verical; ComponentLink8URL: https://datasheet.ciiva.com/22685/1498406-22685833.pdf?src-supplier=Element14; ComponentLink8Description: https://datasheet.ciiva.com/22685/1498406-22685833.pdf?src-supplier=Element14; ComponentLink9URL: https://datasheet.ciiva.com/22692/1498406-22692454.pdf?src-supplier=Element14; ComponentLink9Description: https://datasheet.ciiva.com/22692/1498406-22692454.pdf?src-supplier=Element14
D20 D21 = USBLC6-2P6: TVS DIODE 5.25VWM 17VC SOT666; Item Type: ESD Diode; Direction: Unidirectional,Bidirectional; Operating Supply Voltage: 5V; Number of Elements: 1; Value: 3.5pF; Reverse Breakdown Voltage: 6V; Number of Channels: 2; Clamping Voltage: 17V; Power Line Protection: Yes; Test Current: 1mA; Max Reverse Leakage Current: 150nA; Peak Pulse Current: 5A; Max Repetitive Reverse Voltage (Vrrm): 5.25V; LCSC Part Number: C15999; ComponentLink1Description: LCSC; Supplier: Mouser; Supplier Part Number: 511-USBLC6-2P6; RoHS: Yes; Category: TVS Diodes; Stock: 180020; Pricing: 1=0.59, 10=0.514, 50=0.514, 100=0.356, 1000=0.253, 10000=0.197 (USD); Mounting Technology: Surface Mount; Case/Package: SOT-666; Pins: 6; Min Operating Temperature: -40°C; Max Operating Temperature: 125°C; Package Quantity: 1; Packaging: Tape and Reel; Number of Bidirectional Channels: 2; Reverse Standoff Voltage: 5V; Min Breakdown Voltage: 6V; Polarity: Unidirectional,Bidirectional; Breakdown Voltage: 6V; Termination: SMD/SMT; Working Voltage: 5V; ESD Protection: Yes; Leakage Current: 150nA; Max Breakdown Voltage: 6V; Series: USB; Clamping Voltage-Max: 17V; Number of Unidirectional Channels: 2; Length: 1.7mm; Width: 1.3mm; Height: 0.6mm; Depth: 1.3mm; Radiation Hardening: No; Reach SVHC Compliant: No; Lead Free: Lead Free; RoHS Compliant: Yes; ComponentLink2URL: https://datasheet.ciiva.com/14186/usblc6-2-st-eng-tds-14186568.pdf?src-supplier=Distrelec; ComponentLink2Description: https://datasheet.ciiva.com/14186/usblc6-2-st-eng-tds-14186568.pdf?src-supplier=Distrelec; ComponentLink3URL: https://datasheet.ciiva.com/15143/getdatasheetpartid-98673-15143462.pdf?src-supplier=Verical; ComponentLink3Description: https://datasheet.ciiva.com/15143/getdatasheetpartid-98673-15143462.pdf?src-supplier=Verical; ComponentLink4URL: https://datasheet.ciiva.com/22685/1690354-22685832.pdf?src-supplier=Element14; ComponentLink4Description: https://datasheet.ciiva.com/22685/1690354-22685832.pdf?src-supplier=Element14; ComponentLink5URL: https://datasheet.ciiva.com/22692/1690354-22692453.pdf?src-supplier=Element14; ComponentLink5Description: https://datasheet.ciiva.com/22692/1690354-22692453.pdf?src-supplier=Element14; ComponentLink6URL: https://datasheet.ciiva.com/4508/cd00050750-4508892.pdf?src-supplier=Mouser; ComponentLink6Description: https://datasheet.ciiva.com/4508/cd00050750-4508892.pdf?src-supplier=Mouser; ComponentLink7URL: https://datasheet.ciiva.com/16378/cd00050750-16378714.pdf?src-supplier=Future+Electronics; ComponentLink7Description: https://datasheet.ciiva.com/16378/cd00050750-16378714.pdf?src-supplier=Future+Electronics; ComponentLink8URL: https://datasheet.ciiva.com/41444/001184108-da-01-en-ic-esd-protection-usblc6-2p6-sot-666-stm-41444134.pdf?src-supplier=Conrad; ComponentLink8Description: https://datasheet.ciiva.com/41444/001184108-da-01-en-ic-esd-protection-usblc6-2p6-sot-666-stm-41444134.pdf?src-supplier=Conrad
R10 = RC0201FR-074K7L: RES SMD 4.7K OHM 1% 1/20W 0201; Manufacturer: Yageo; Resistance: 4.7kR; Temperature Coefficient: 200ppm/°C; Power Rating: 50mW; Voltage Rating: 25V; Supplier 1: Digi-Key; Manufacturer Part Number: RC0201FR-074K7L; Stock 1: 2128413; Pricing 1: 1=0.1, 10=0.04, 100=0.0165, 1000=0.00739, 2500=0.00642, 5000=0.0053 (USD); Case/Package: 0201; Weight: 6E-06oz; Contact Plating: Tin,Matte; Case Code (Metric): 0603; Case Code (Imperial): 0201; Min Operating Temperature: -55°C; Max Operating Temperature: 125°C; Tolerance: 1%; Composition: Thick Film; Packaging: Tape and Reel; Package Quantity: 1; Number of Terminations: 2; Termination: SMD/SMT; Military Standard: Not; Max Power Dissipation: 50mW; Features: Moisture Resistant; Length: 0.6mm; Height: 0.01inch; Width: 0.012inch; Depth: 0.3mm; Radiation Hardening: No; REACH SVHC: Unknown; Lead Free: Lead Free; ComponentLink1URL: http://www.yageo.com/documents/recent/PYu-RC_Group_51_RoHS_L_10.pdf?src-supplier=Digi-Key; ComponentLink1Description: http://www.yageo.com/documents/recent/PYu-RC_Group_51_RoHS_L_10.pdf?src-supplier=Digi-Key; ComponentLink2URL: http://www.farnell.com/datasheets/2167052.pdf?src-supplier=Element14; ComponentLink2Description: http://www.farnell.com/datasheets/2167052.pdf?src-supplier=Element14; ComponentLink3URL: http://www.yageo.com/documents/recent/PYu-RC0201_51_RoHS_L_8.pdf?src-supplier=Avnet+Europe; ComponentLink3Description: http://www.yageo.com/documents/recent/PYu-RC0201_51_RoHS_L_8.pdf?src-supplier=Avnet+Europe; ComponentLink4URL: http://www.yageo.com/documents/recent/PYu-RC0201_51_RoHS_L_8.pdf?src-supplier=Avnet; ComponentLink4Description: http://www.yageo.com/documents/recent/PYu-RC0201_51_RoHS_L_8.pdf?src-supplier=Avnet; Supplier Part Number 1: 311-4.70KMCT-ND
U8 = ISO7740FDBQR: DGTL ISO 3000VRMS 4CH GP 16SSOP; Item Type: IC; LCSC Part Number: C544482; ComponentLink1Description: LCSC; Supplier: Mouser; Supplier Part Number: 595-ISO7740FDBQR; RoHS: Yes; Category: Integrated Circuits (ICs); Stock: 3733; Pricing: 1=2.67, 10=2.34, 50=2.34, 100=1.95, 1000=1.47, 10000=1.2 (USD); ComponentLink2URL: http://www.ti.com/general/docs/suppproductinfo.tsp?distId=10&amp;gotoUrl=http%3A%2F%2Fwww.ti.com%2Flit%2Fgpn%2Fiso7742&src-supplier=Digi-Key; ComponentLink2Description: http://www.ti.com/general/docs/suppproductinfo.tsp?distId=10&amp;gotoUrl=http%3A%2F%2Fwww.ti.com%2Flit%2Fgpn%2Fiso7742&src-supplier=Digi-Key; ComponentLink3URL: http://www.ti.com/lit/ds/symlink/iso7742.pdf?src-supplier=Digi-Key; ComponentLink3Description: http://www.ti.com/lit/ds/symlink/iso7742.pdf?src-supplier=Digi-Key
U9 = ISO6762FQDWRQ1: AUTOMOTIVE, GENERAL-PURPOSE, 50-; Item Type: IC; LCSC Part Number: C5216383; ComponentLink1Description: LCSC; Supplier: Mouser; Supplier Part Number: 595-ISO6762FQDWRQ1; RoHS: No; Category: Integrated Circuits (ICs); Stock: 8302; Pricing: 1=3.36, 10=2.94, 50=2.94, 100=2.48, 1000=1.78, 10000=1.77 (USD)
U10 = SN74LVTH125PWR: IC BUS BUFFER TRI-ST QD 14TSSOP; Manufacturer: Texas Instruments; Logic Function: Buffer,Inverting; Polarity: Non-Inverting; Propagation Delay: 2.1ns; Min Supply Voltage: 2.7V; Max Supply Voltage: 3.6V; Number of Channels: 4; Operating Supply Voltage: 3.3V; Number of Bits per Element: 1; High Level Output Current: -32mA; Low Level Output Current: 64mA; Quiescent Current: 7mA; Number of Output Lines: 3; Supplier 1: Digi-Key; Manufacturer Part Number: SN74LVTH125PWR; RoHS: Yes; Category: Logic Gates; Stock 1: 980; Pricing 1: 1=0.64000, 10=0.56000, 25=0.52560, 100=0.42910, 250=0.39856, 500=0.33920, 1000=0.28000 (USD); Mount: Surface Mount; Case/Package: TSSOP; Number of Pins: 14; Contact Plating: Gold; Min Operating Temperature: -40°C; Max Operating Temperature: 85°C; Packaging: Tape and Reel; Number of Outputs: 4; Package Quantity: 2000; Number of Elements: 4; Turn-On Delay Time: 2.1ns; Number of Bits: 4; Number of Inputs: 4; Number of Input Lines: 4; Number of Gates: 4; Output Current: 64mA; Length: 5mm; Width: 4.4mm; Height: 1.15mm; Radiation Hardening: No; Lead Free: Lead Free; RoHS Compliant: Yes; REACH SVHC: No SVHC; ComponentLink1URL: https://datasheet.ciiva.com/41455/001017258-da-01-en-ic-bus-buf-q-sn74lvth125pwr-tssop-14-tid-41455824.pdf?src-supplier=Conrad; ComponentLink1Description: https://datasheet.ciiva.com/41455/001017258-da-01-en-ic-bus-buf-q-sn74lvth125pwr-tssop-14-tid-41455824.pdf?src-supplier=Conrad; ComponentLink2URL: https://datasheet.ciiva.com/46442/1764295-46442090.pdf?src-supplier=Element14; ComponentLink2Description: https://datasheet.ciiva.com/46442/1764295-46442090.pdf?src-supplier=Element14; ComponentLink3URL: https://datasheet.ciiva.com/1834/sn74lvth125-1834408.pdf?src-supplier=Digi-Key; ComponentLink3Description: https://datasheet.ciiva.com/1834/sn74lvth125-1834408.pdf?src-supplier=Digi-Key; ComponentLink4URL: https://datasheet.ciiva.com/1834/sn74lvth125-1834407.pdf?src-supplier=Digi-Key; ComponentLink4Description: https://datasheet.ciiva.com/1834/sn74lvth125-1834407.pdf?src-supplier=Digi-Key; ComponentLink5URL: https://datasheet.ciiva.com/7795/sn74lvth125-7795066.pdf?src-supplier=Element14; ComponentLink5Description: https://datasheet.ciiva.com/7795/sn74lvth125-7795066.pdf?src-supplier=Element14; ComponentLink6URL: https://datasheet.ciiva.com/14301/scbs703i-14301146.pdf?src-supplier=Avnet; ComponentLink6Description: https://datasheet.ciiva.com/14301/scbs703i-14301146.pdf?src-supplier=Avnet; ComponentLink7URL: https://datasheet.ciiva.com/26263/sn74lvth125-26263836.pdf?src-supplier=Avnet+Europe; ComponentLink7Description: https://datasheet.ciiva.com/26263/sn74lvth125-26263836.pdf?src-supplier=Avnet+Europe; Supplier Part Number 1: 296-8660-1-ND